# Altium project Altium Simulation.PrjPcb
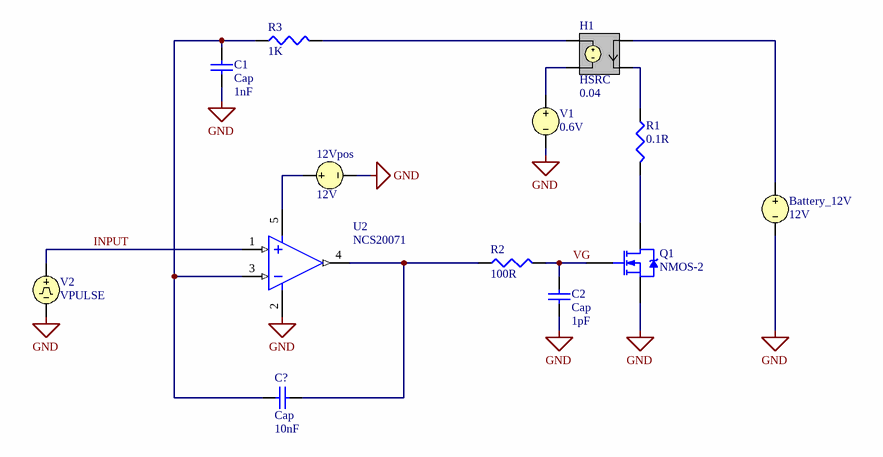
[diagram p0: Altium Simulation.SchDoc]
1 sheet, 13 parts. Net scope: global (net labels, ports and power ports of the same name join across sheets).
Board file: Altium Simulation.PcbDoc

## Sheet Altium Simulation.SchDoc
size A4; Organization: ArSilicii s.r.l.; Address1: Via Sardegna, 11; Address2: 53036 Poggibonsi (SI)  - ITALY -; Address3: e-mail : ArSilicii@ArSilicii.com; SheetNumber: 0; SheetTotal: 0

### Parts
12Vpos  12V
Battery_12V  12V
C1  Cap  value 1nF  [RAD-0.3]
C2  Cap  value 1pF  [RAD-0.3]
C?  Cap  value 10nF  [RAD-0.3]
H1  HSRC  Gain: 0.04
Q1  NMOS-2  [TO-220AB]
R1  0.1R  [J1-0603]
R2  100R  [J1-0603]
R3  1K  [J1-0603]
U2  NCS20071  [SOT-553-5]
V1  0.6V
V2  VPULSE

### Nets
GND: 12Vpos.2 Battery_12V.2 C1.1 C2.1 Q1.3(S) U2.2 V1.2 V2.2
INPUT: U2.1 V2.1
VG: C2.2 Q1.1(G) R2.2
Net12Vpos_1: 12Vpos.1 U2.5
NetBattery_12V_1: Battery_12V.1 H1.1(NC+)
NetC1_2: C1.2 C?.1 R3.1 U2.3
NetC?_2: C?.2 R2.1 U2.4
NetH1_2: H1.2(NC-) R1.1
NetH1_3: H1.3(N+) R3.2
NetH1_4: H1.4(N-) V1.1
NetQ1_2: Q1.2(D) R1.2

### Notes on the sheet
- Title :
- Size:
- Date:
- A4
- Version:
- Sheet
- of
- Designer:
- Revisor:

### Library data of the parts
12Vpos Battery_12V V1 = VSRC: Voltage Source; Note: PCB Footprint - Not required; Published: 8-Jun-2000; LatestRevisionDate: 17-Jul-2002; LatestRevisionNote: Re-released for DXP Platform.; PackageReference: Not Applicable; Publisher: Altium Limited
  12Vpos Battery_12V: Value: 12V
  V1: Value: 0.6V
C1 C2 C? = Cap: Capacitor; Published: 8-Jun-2000; LatestRevisionDate: 17-Jul-2002; LatestRevisionNote: Re-released for DXP Platform.; PackageReference: RAD-0.3; Publisher: Altium Limited; PackageDescription: Radial Cap, Thru-Hole; 2 Leads; 0.3 in Pin Spacing
H1 = HSRC: Current Controlled Voltage Source; Note: PCB Footprint - Not required; Sim Note: Enter gain into gain field; Published: 8-Jun-2000; LatestRevisionDate: 17-Jul-2002; LatestRevisionNote: Re-released for DXP Platform.; PackageReference: Not Applicable; Publisher: Altium Limited
Q1 = NMOS-2: N-Channel Power MOSFET; Note: Pin 2 is electrically connected to pin 4.; Published: 8-Jun-2000; LatestRevisionDate: 17-Jul-2002; LatestRevisionNote: Re-released for DXP Platform.; DatasheetVersion: PD-9.814; PackageVersion: Feb-1997; PackageReference: TO-220AB; Publisher: Altium Limited; PackageDescription: TO, Thru-Hole, Vertical, Heatsink Mounted; 3 In-Line Leads; Pitch 2.54 mm; ComponentLink1Description: Manufacturer Link; ComponentLink1URL: http://www.irf.com/
R1-R3 = Res3: Resistor; Published: 8-Jun-2000; LatestRevisionDate: 29-May-2009; LatestRevisionNote: IPC-7351 Footprint Added.; PackageReference: J1-0603; Publisher: Altium Limited; PackageDescription: Chip Resistor
  R1: Value: 0.1R; Parameter 1: *
  R2: Value: 100R
  R3: Value: 1K
U2 = NCS20071: Rail-to-Rail Input/Output, 3 MHz Op Amps; Manufacturer: Microchip Technology; Manufacturer Part Number: MCP6021-E/SN; SMD/TH: SMD; 1 Supplier: DigiKey; 1 Supplier Part Number: MCP6021-E/SN-ND; 1 Supplier Unit Price: 1,22; 2 Supplier: *; 2 Supplier Part Number: *; 2 Supplier Unit Price: *; 3 Supplier: *; 3 Supplier Part Number: *; 3 Supplier Unit Price: *; ArSilicii Part Number: *; ComponentLink1URL: http://ww1.microchip.com/downloads/en/DeviceDoc/21685d.pdf; ComponentLink2URL: *; ComponentLink1Description: Datasheet for MCP6021; ComponentLink2Description: *; HelpURL: *
V2 = VPULSE: Pulse Voltage Source; Note: PCB Footprint - Not required; Published: 8-Jun-2000; LatestRevisionDate: 15-Nov-2004; LatestRevisionNote: Corrected Netlist.; PackageReference: Not Applicable; Publisher: Altium Limited